# EAGLE design Witch (EAGLE 9.6.2)
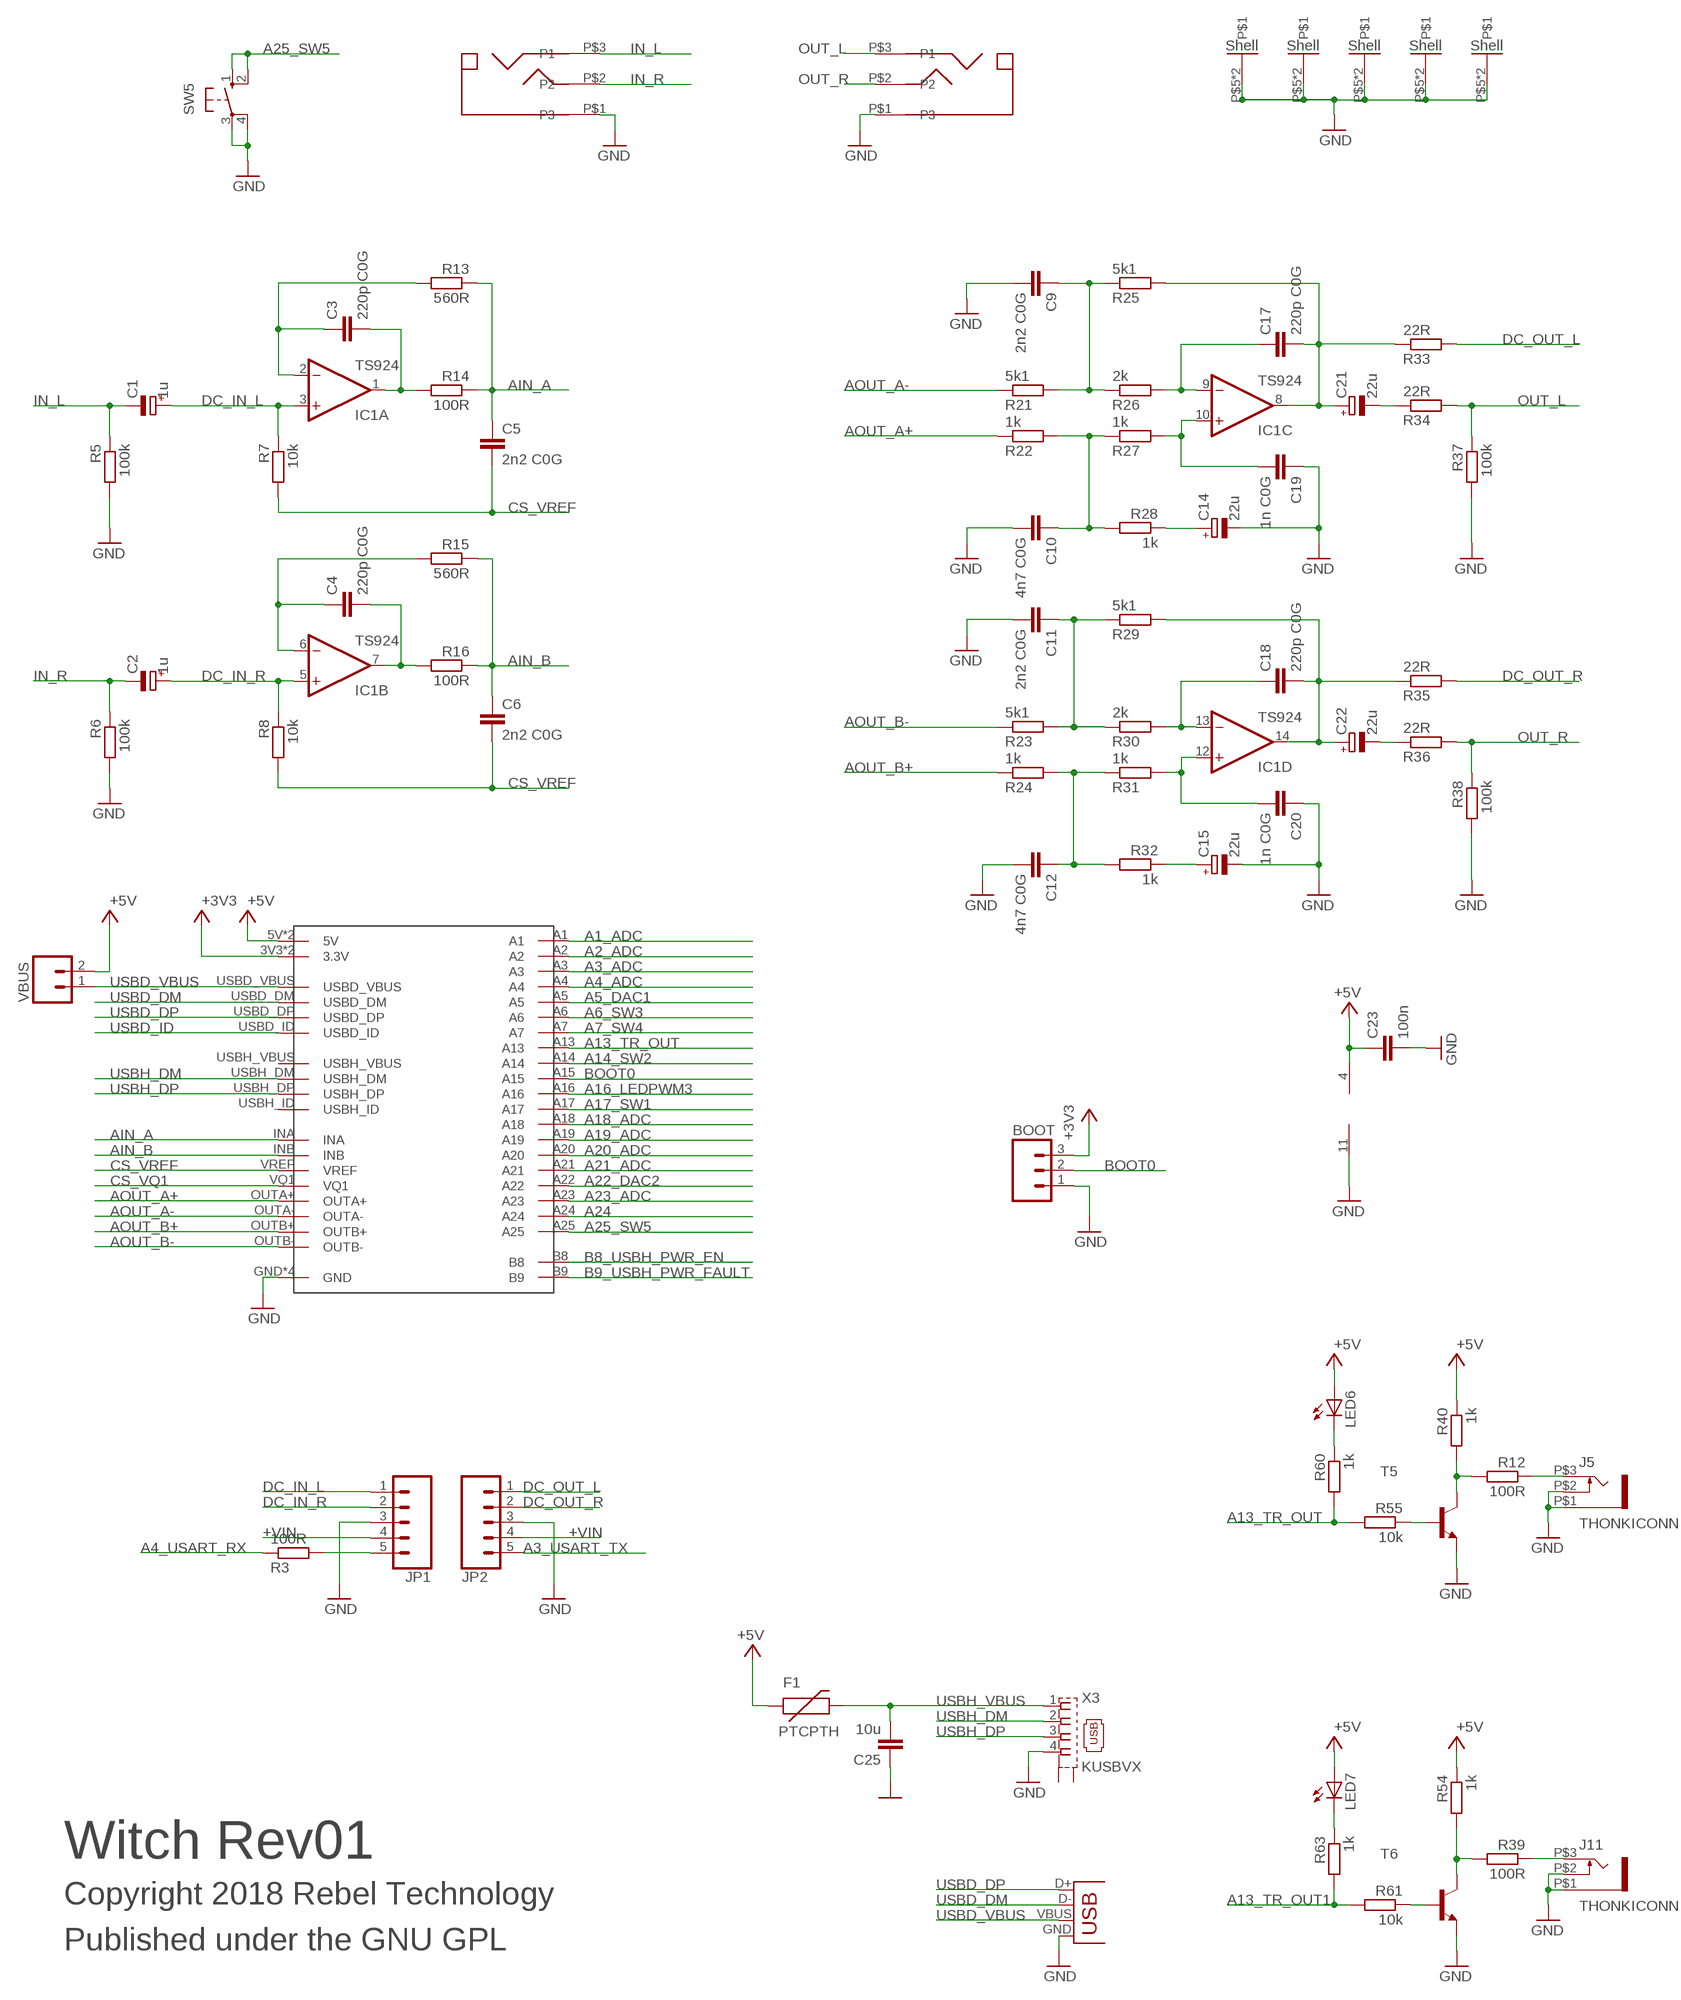
[diagram p0: schematic, sheet 1, part 1 of 2]
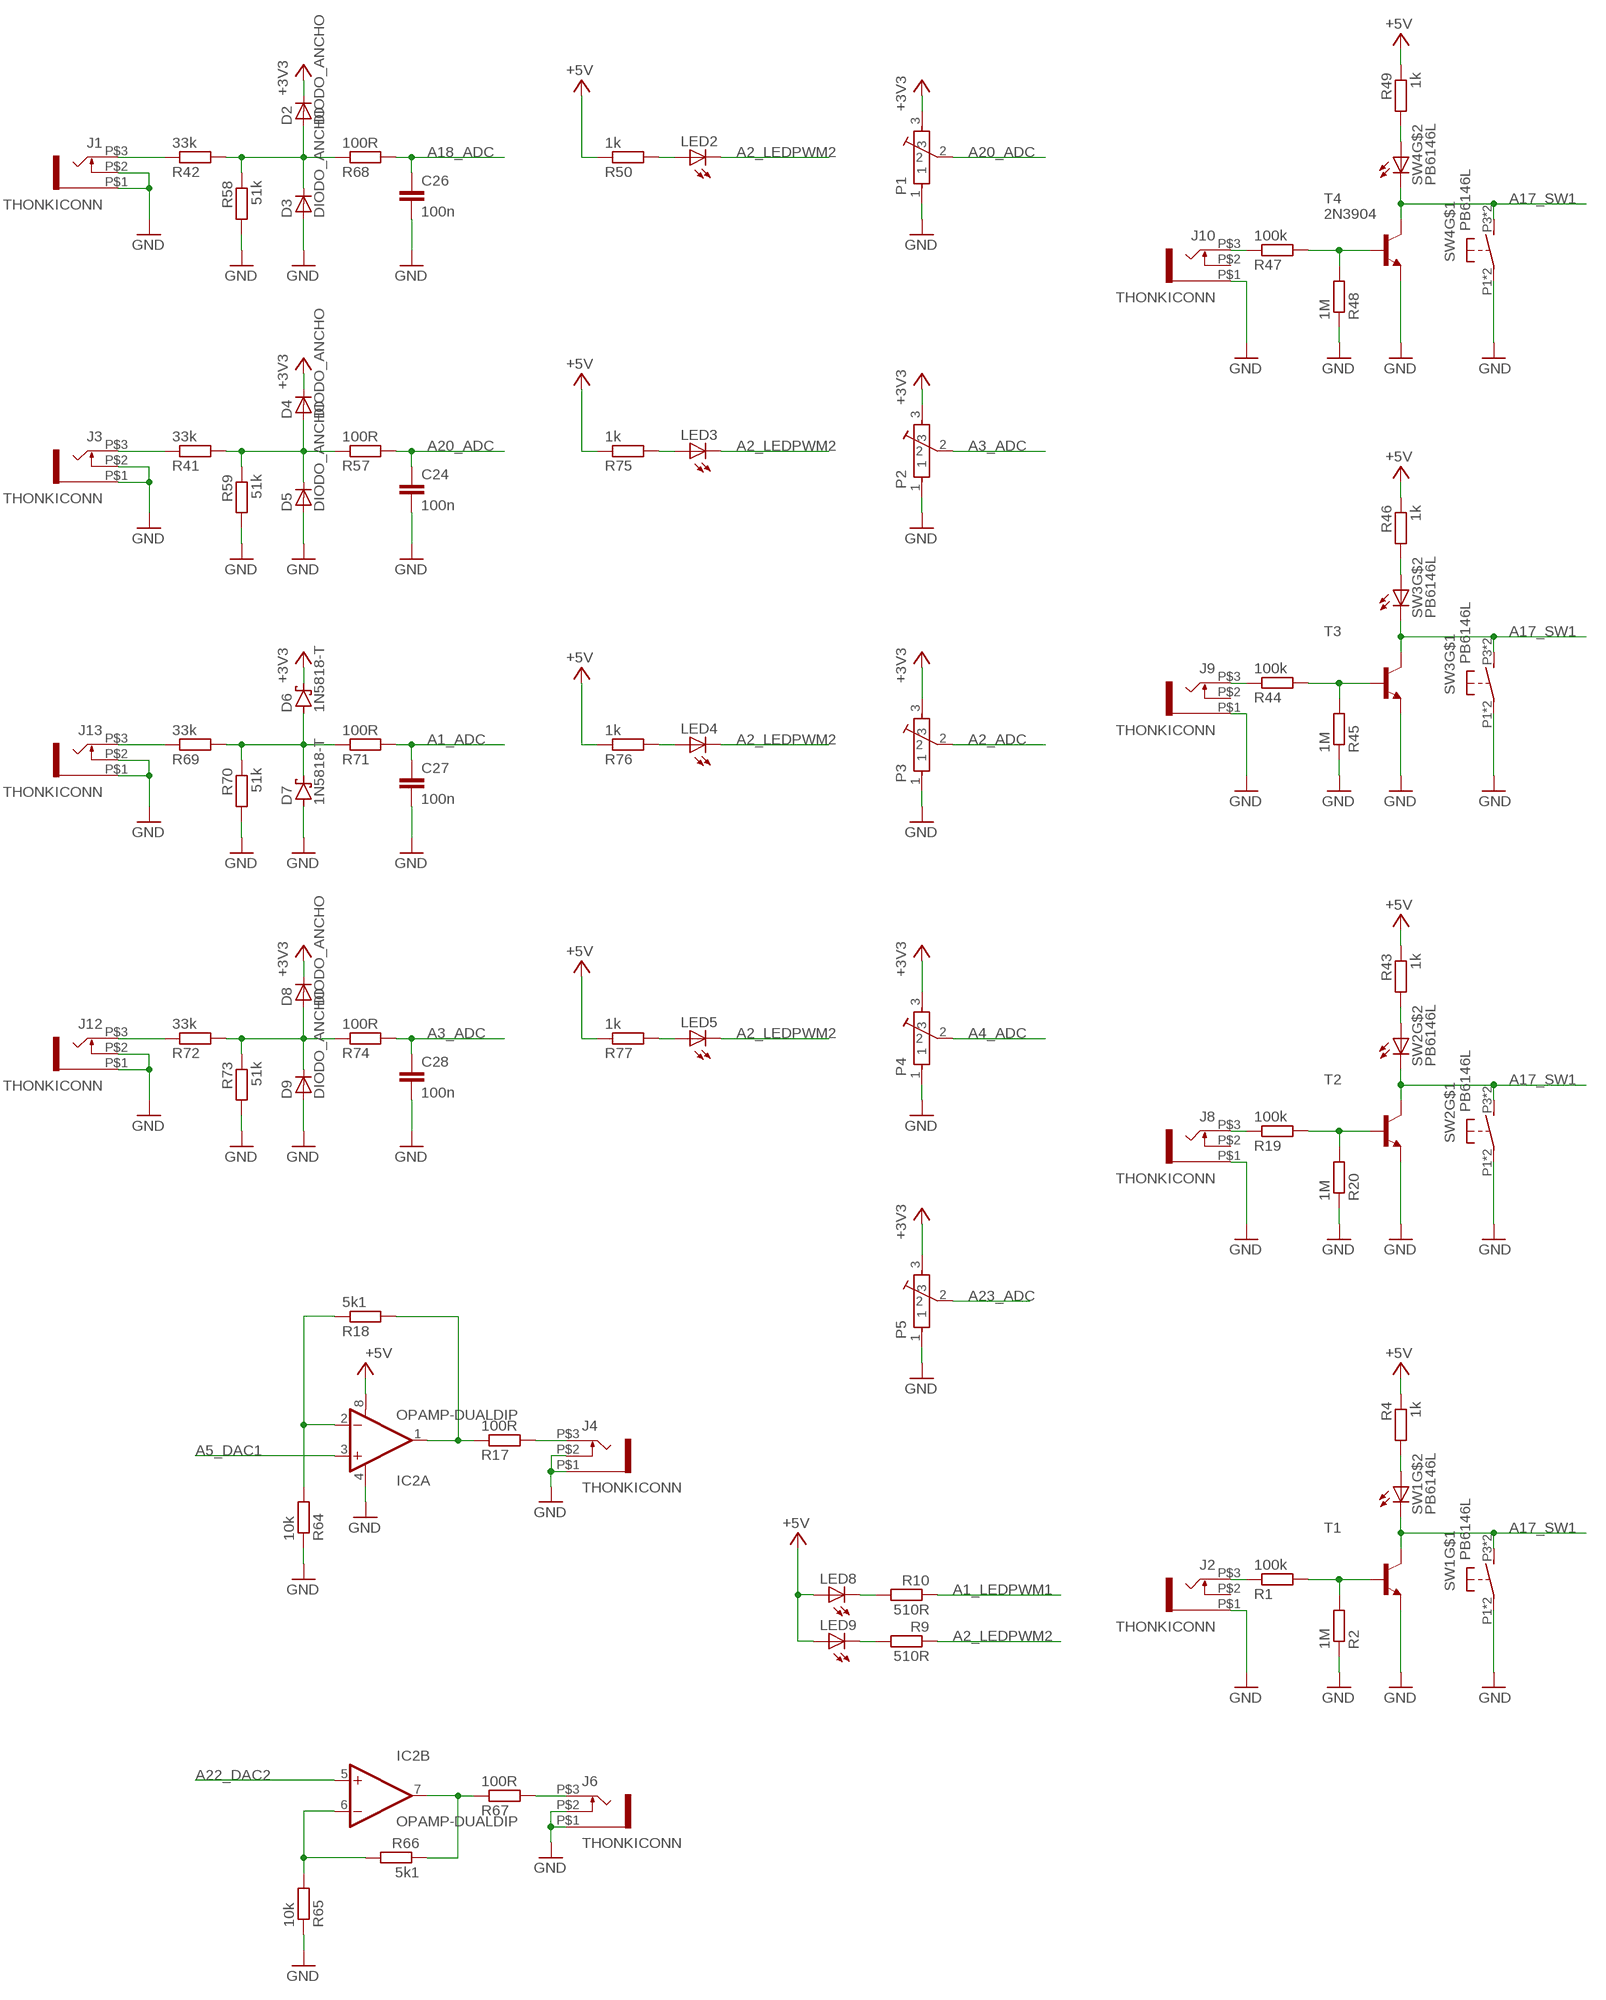
[diagram p1: schematic, sheet 1, part 2 of 2]

## Parts
BOOT  M03PTH  [1X03]
C1  1u  CPOL-EUE1.8-4  [E1,8-4]
C2  1u  CPOL-EUE1.8-4  [E1,8-4]
C3  220p C0G  C-EU050-025X075  [C050-025X075]
C4  220p C0G  C-EU050-025X075  [C050-025X075]
C5  2n2 C0G  C-EU050-025X075  [C050-025X075]
C6  2n2 C0G  C-EU050-025X075  [C050-025X075]
C9  2n2 C0G  C-EU050-025X075  [C050-025X075]
C10  4n7 C0G  C-EU050-025X075  [C050-025X075]
C11  2n2 C0G  C-EU050-025X075  [C050-025X075]
C12  4n7 C0G  C-EU050-025X075  [C050-025X075]
C14  22u  CPOL-EUE1.8-4  [E1,8-4]
C15  22u  CPOL-EUE1.8-4  [E1,8-4]
C17  220p C0G  C-EU050-025X075  [C050-025X075]
C18  220p C0G  C-EU050-025X075  [C050-025X075]
C19  1n C0G  C-EU050-025X075  [C050-025X075]
C20  1n C0G  C-EU050-025X075  [C050-025X075]
C21  22u  CPOL-EUE1.8-4  [E1,8-4]
C22  22u  CPOL-EUE1.8-4  [E1,8-4]
C23  100n  C-EU050-025X075  [C050-025X075]
C24  100n  C-EU050-025X075  [C050-025X075]
C25  10u  C-EU050-025X075  [C050-025X075]
C26  100n  C-EU050-025X075  [C050-025X075]
C27  100n  C-EU050-025X075  [C050-025X075]
C28  100n  C-EU050-025X075  [C050-025X075]
D2  DIODO_ANCHO  [D-5.2]
D3  DIODO_ANCHO  [D-5.2]
D4  DIODO_ANCHO  [D-5.2]
D5  DIODO_ANCHO  [D-5.2]
D6  1N5818-T  [DO41-7.6]
D7  1N5818-T  [DO41-7.6]
D8  DIODO_ANCHO  [D-5.2]
D9  DIODO_ANCHO  [D-5.2]
F1  PTCPTH  [PTC]
IC1  TS924  LM324N  [DIL14]
IC2  OPAMP-DUALDIP  [DIP08]
J1  THONKICONN  [THONKICONN]
J2  THONKICONN  [THONKICONN]
J3  THONKICONN  [THONKICONN]
J4  THONKICONN  [THONKICONN]
J5  THONKICONN  [THONKICONN]
J6  THONKICONN  [THONKICONN]
J8  THONKICONN  [THONKICONN]
J9  THONKICONN  [THONKICONN]
J10  THONKICONN  [THONKICONN]
J11  THONKICONN  [THONKICONN]
J12  THONKICONN  [THONKICONN]
J13  THONKICONN  [THONKICONN]
JP1  CONN_05JST-VERT  [JST-5-PTH-VERT]
JP2  CONN_05JST-VERT  [JST-5-PTH-VERT]
LED2  LED3MM  [LED3MM]
LED3  LED3MM  [LED3MM]
LED4  LED3MM  [LED3MM]
LED5  LED3MM  [LED3MM]
LED6  LED3MM  [LED3MM]
LED7  LED3MM  [LED3MM]
LED8  LED3MM  [LED3MM]
LED9  LED3MM  [LED3MM]
P1  POT-ALPS-RK09L1140  [POT-ALPS-RK09L1140]
P2  POT-ALPS-RK09L1140  [POT-ALPS-RK09L1140]
P3  POT-ALPS-RK09L1140  [POT-ALPS-RK09L1140]
P4  POT-ALPS-RK09L1140  [POT-ALPS-RK09L1140]
P5  POT-ALPS-RK09L1140  [POT-ALPS-RK09L1140]
R1  100k  R-EU_0204/5  [0204/5]
R2  1M  R-EU_0204/5  [0204/5]
R3  100R  R-EU_0204/5  [0204/5]
R4  1k  R-EU_0204/5  [0204/5]
R5  100k  R-EU_0204/5  [0204/5]
R6  100k  R-EU_0204/5  [0204/5]
R7  10k  R-EU_0204/5  [0204/5]
R8  10k  R-EU_0204/5  [0204/5]
R9  510R  R-EU_0204/5  [0204/5]
R10  510R  R-EU_0204/5  [0204/5]
R12  100R  R-EU_0204/5  [0204/5]
R13  560R  R-EU_0204/5  [0204/5]
R14  100R  R-EU_0204/5  [0204/5]
R15  560R  R-EU_0204/5  [0204/5]
R16  100R  R-EU_0204/5  [0204/5]
R17  100R  R-EU_0204/5  [0204/5]
R18  5k1  R-EU_0204/5  [0204/5]
R19  100k  R-EU_0204/5  [0204/5]
R20  1M  R-EU_0204/7  [0204/7]
R21  5k1  R-EU_0204/5  [0204/5]
R22  1k  R-EU_0204/5  [0204/5]
R23  5k1  R-EU_0204/5  [0204/5]
R24  1k  R-EU_0204/5  [0204/5]
R25  5k1  R-EU_0204/5  [0204/5]
R26  2k  R-EU_0204/5  [0204/5]
R27  1k  R-EU_0204/5  [0204/5]
R28  1k  R-EU_0204/5  [0204/5]
R29  5k1  R-EU_0204/5  [0204/5]
R30  2k  R-EU_0204/5  [0204/5]
R31  1k  R-EU_0204/5  [0204/5]
R32  1k  R-EU_0204/5  [0204/5]
R33  22R  R-EU_0204/5  [0204/5]
R34  22R  R-EU_0204/5  [0204/5]
R35  22R  R-EU_0204/5  [0204/5]
R36  22R  R-EU_0204/5  [0204/5]
R37  100k  R-EU_0204/5  [0204/5]
R38  100k  R-EU_0204/5  [0204/5]
R39  100R  R-EU_0204/5  [0204/5]
R40  1k  R-EU_0204/5  [0204/5]
R41  33k  R-EU_0204/5  [0204/5]
R42  33k  R-EU_0204/5  [0204/5]
R43  1k  R-EU_0204/5  [0204/5]
R44  100k  R-EU_0204/5  [0204/5]
R45  1M  R-EU_0204/5  [0204/5]
R46  1k  R-EU_0204/5  [0204/5]
R47  100k  R-EU_0204/5  [0204/5]
R48  1M  R-EU_0204/5  [0204/5]
R49  1k  R-EU_0204/5  [0204/5]
R50  1k  R-EU_0204/5  [0204/5]
R54  1k  R-EU_0204/5  [0204/5]
R55  10k  R-EU_0204/5  [0204/5]
R57  100R  R-EU_0204/5  [0204/5]
R58  51k  R-EU_0204/5  [0204/5]
R59  51k  R-EU_0204/5  [0204/5]
R60  1k  R-EU_0204/5  [0204/5]
R61  10k  R-EU_0204/5  [0204/5]
R63  1k  R-EU_0204/5  [0204/5]
R64  10k  R-EU_0204/5  [0204/5]
R65  10k  R-EU_0204/5  [0204/5]
R66  5k1  R-EU_0204/5  [0204/5]
R67  100R  R-EU_0204/5  [0204/5]
R68  100R  R-EU_0204/5  [0204/5]
R69  33k  R-EU_0204/5  [0204/5]
R70  51k  R-EU_0204/5  [0204/5]
R71  100R  R-EU_0204/5  [0204/5]
R72  33k  R-EU_0204/5  [0204/5]
R73  51k  R-EU_0204/5  [0204/5]
R74  100R  R-EU_0204/5  [0204/5]
R75  1k  R-EU_0204/5  [0204/5]
R76  1k  R-EU_0204/5  [0204/5]
R77  1k  R-EU_0204/5  [0204/5]
SW1  PB6146L  [PB6146L]
SW2  PB6146L  [PB6146L]
SW3  PB6146L  [PB6146L]
SW4  PB6146L  [PB6146L]
SW5  10-XX  [B3F-10XX]
T1  2N3904-NPN-TO92-EBC  [TO92-EBC]
T2  2N3904-NPN-TO92-EBC  [TO92-EBC]
T3  2N3904-NPN-TO92-EBC  [TO92-EBC]
T4  2N3904  [TO92]
T5  2N3904-NPN-TO92-EBC  [TO92-EBC]
T6  2N3904-NPN-TO92-EBC  [TO92-EBC]
U$4  THONKICONN_STEREO  [THONKICONN_STEREO]
U$5  THONKICONN_STEREO  [THONKICONN_STEREO]
U$10  OWL_DIGITAL_LITE_2USB  [OWL_DIGITAL_LITE_2USB]
VBUS  M02PTH  [1X02]
X3  KUSBVX  [KUSBVX]
X5  USBPTH-VERTICAL  [USB-B-PTH-VERTICAL]

## Nets
+3V3: BOOT.3 D2.C D4.C D6.C D8.C P1.3 P2.3 P3.3 P4.3 P5.3 U$10.3V3(3.3V) U$10.3V3_2(3.3V)
+5V: C23.1 F1.P$1 IC1.4(P:V+) IC2.8(A:V+) LED6.A LED7.A LED8.A LED9.A R4.1 R40.1 R43.1 R46.1 R49.1 R50.1 R54.1 R75.1 R76.1 R77.1 U$10.5V U$10.5V_2(5V) VBUS.2
+VIN: JP1.4 JP2.4
A1_ADC: C27.1 R71.2 U$10.A1
A1_LEDPWM1: R10.1
A2_ADC: P3.2 U$10.A2
A2_LEDPWM2: LED2.K(C) LED3.K(C) LED4.K(C) LED5.K(C) R9.1
A3_ADC: C28.1 R74.2 U$10.A3
A3_USART_TX: JP2.5
A4_ADC: P4.2 U$10.A4
A4_USART_RX: R3.1
A5_DAC1: IC2.3(A:+IN) U$10.A5
A6_SW3: U$10.A6
A7_SW4: U$10.A7
A13_TR_OUT: R55.2 R60.2 U$10.A13
A13_TR_OUT1: R61.2 R63.2
A14_SW2: U$10.A14
A16_LEDPWM3: U$10.A16
A17_SW1: SW1.P3(S) SW1.P4(S) SW1.PL2(C) SW2.P3(S) SW2.P4(S) SW2.PL2(C) SW3.P3(S) SW3.P4(S) SW3.PL2(C) SW4.P3(S) SW4.P4(S) SW4.PL2(C) T1.C T2.C T3.C T4.1(C) U$10.A17
A18_ADC: C26.1 R68.2 U$10.A18
A19_ADC: P1.2 U$10.A19
A20_ADC: C24.1 R57.2 U$10.A20
A21_ADC: P2.2 U$10.A21
A22_DAC2: IC2.5(B:+IN) U$10.A22
A23_ADC: P5.2 U$10.A23
A24: U$10.A24
A25_SW5: SW5.1(S) SW5.2(S1) U$10.A25
AIN_A: C5.1 R13.1 R14.1 U$10.INA
AIN_B: C6.1 R15.1 R16.1 U$10.INB
AOUT_A+: R22.1 U$10.OUTA+
AOUT_A-: R21.1 U$10.OUTA-
AOUT_B+: R24.1 U$10.OUTB+
AOUT_B-: R23.1 U$10.OUTB-
B8_USBH_PWR_EN: U$10.B8
B9_USBH_PWR_FAULT: U$10.B9
BOOT0: BOOT.2 U$10.A15
CS_VQ1: U$10.VQ1
CS_VREF: C5.2 C6.2 R7.2 R8.2 U$10.VREF
DC_IN_L: C1.+ IC1.3(A:+IN) JP1.1 R7.1
DC_IN_R: C2.+ IC1.5(B:+IN) JP1.2 R8.1
DC_OUT_L: JP2.1 R33.2
DC_OUT_R: JP2.2 R35.2
GND: BOOT.1 C9.2 C10.2 C11.2 C12.2 C14.- C15.- C19.1 C20.1 C23.2 C24.2 C25.1 C26.2 C27.2 C28.2 D3.A D5.A D7.A D9.A IC1.11(P:V-) IC2.4(A:V-) J1.P$1 J1.P$2 J2.P$1 J3.P$1 J3.P$2 J4.P$1 J4.P$2 J5.P$1 J5.P$2 J6.P$1 J6.P$2 J8.P$1 J9.P$1 J10.P$1 J11.P$1 J11.P$2 J12.P$1 J12.P$2 J13.P$1 J13.P$2 JP1.3 JP2.3 P1.1 P1.P$5 P1.P$6 P2.1 P2.P$5 P2.P$6 P3.1 P3.P$5 P3.P$6 P4.1 P4.P$5 P4.P$6 P5.1 P5.P$5 P5.P$6 R2.1 R5.2 R6.2 R20.1 R37.2 R38.2 R45.1 R48.1 R58.2 R59.2 R64.1 R65.1 R70.2 R73.2 SW1.P1(P) SW1.P2(P) SW2.P1(P) SW2.P2(P) SW3.P1(P) SW3.P2(P) SW4.P1(P) SW4.P2(P) SW5.3(P) SW5.4(P1) T1.E T2.E T3.E T4.3(E) T5.E T6.E U$4.P$1(P3) U$5.P$1(P3) U$10.GND U$10.GND_2(GND) U$10.GND_3(GND) U$10.GND_4(GND) X3.4 X5.GND
IN_L: C1.- R5.1 U$4.P$3(P1)
IN_R: C2.- R6.1 U$4.P$2(P2)
N$1: JP1.5 R3.2
N$2: J11.P$3 R39.1
N$3: C3.1 IC1.2(A:-IN) R13.2
N$4: C4.2 IC1.7(B:OUT) R16.2
N$5: C4.1 IC1.6(B:-IN) R15.2
N$6: C3.2 IC1.1(A:OUT) R14.2
N$7: C17.1 IC1.9(C:-IN) R26.2
N$8: C15.+ R32.1
N$9: C21.- R34.1
N$10: C14.+ R28.1
N$11: C19.2 IC1.10(C:+IN) R27.2
N$12: C18.2 C22.+ IC1.14(D:OUT) R29.2 R35.1
N$13: C22.- R36.1
N$14: LED8.K(C) R10.2
N$15: C10.1 R22.2 R27.1 R28.2
N$16: LED9.K(C) R9.2
N$17: D4.A D5.C R41.2 R57.1 R59.1
N$18: LED7.K(C) R63.1
N$19: J5.P$3 R12.1
N$20: IC2.2(A:-IN) R18.1 R64.2
N$21: IC2.1(A:OUT) R17.1 R18.2
N$22: J2.P$3 R1.1
N$23: R39.2 R54.2 T6.C
N$24: C11.1 R23.2 R29.1 R30.1
N$25: R12.2 R40.2 T5.C
N$26: C18.1 IC1.13(D:-IN) R30.2
N$27: J3.P$3 R41.1
N$28: R4.2 SW1.PL1(A)
N$29: R19.2 R20.2 T2.B
N$30: C20.2 IC1.12(D:+IN) R31.2
N$31: R55.1 T5.B
N$32: C12.1 R24.2 R31.1 R32.2
N$33: J1.P$3 R42.1
N$34: J8.P$3 R19.1
N$35: R43.2 SW2.PL1(A)
N$36: R44.2 R45.2 T3.B
N$37: R1.2 R2.2 T1.B
N$38: J9.P$3 R44.1
N$39: C17.2 C21.+ IC1.8(C:OUT) R25.2 R33.1
N$40: R46.2 SW3.PL1(A)
N$41: C9.1 R21.2 R25.1 R26.1
N$42: R47.2 R48.2 T4.2(B)
N$43: J10.P$3 R47.1
N$44: R49.2 SW4.PL1(A)
N$45: LED2.A R50.2
N$46: LED6.K(C) R60.1
N$52: D2.A D3.C R42.2 R58.1 R68.1
N$53: J13.P$3 R69.1
N$54: R61.1 T6.B
N$58: D6.A D7.C R69.2 R70.1 R71.1
N$59: J12.P$3 R72.1
N$60: J4.P$3 R17.2
N$61: IC2.6(B:-IN) R65.2 R66.2
N$62: IC2.7(B:OUT) R66.1 R67.1
N$63: J6.P$3 R67.2
N$64: D8.A D9.C R72.2 R73.1 R74.1
N$65: LED3.A R75.2
N$66: LED4.A R76.2
N$67: LED5.A R77.2
OUT_L: R34.2 R37.1 U$5.P$3(P1)
OUT_R: R36.2 R38.1 U$5.P$2(P2)
USBD_DM: U$10.USBD_DM X5.D-
USBD_DP: U$10.USBD_DP X5.D+
USBD_ID: U$10.USBD_ID
USBD_VBUS: U$10.USBD_VBUS VBUS.1 X5.VBUS
USBH_DM: U$10.USBH_DM X3.2
USBH_DP: U$10.USBH_DP X3.3
USBH_VBUS: C25.2 F1.P$2 X3.1
Unconnected: J2.P$2 J8.P$2 J9.P$2 J10.P$2 U$10.USBH_ID U$10.USBH_VBUS X3.M1(S1) X3.M2(S2)

## Notes on the sheet
- Witch Rev01
- Copyright 2018 Rebel Technology
- Published under the GNU GPL

## Library data of the parts
BOOT = SparkFun:M03: Header 3 Standard 3-pin 0.1" header. Use with straight break away headers (SKU : PRT-00116), right angle break away headers (PRT-00553), swiss pins (PRT-00743), machine pins (PRT-00117), and female headers (PRT-00115). Molex polarized connector foot print use with SKU : PRT-08232 with associated crimp pins and housings.
C1 C2 C14 C15 C21 C22 = rcl:CPOL-EU: POLARIZED CAPACITOR, European symbol
C3-C6 C9-C12 C17-C20 C23-C28 = rcl:C-EU: CAPACITOR, European symbol
D2-D5 D8 D9 = diode:DIODO_ANCHO
D6 D7 = diode:1N581*: 1.0A SCHOTTKY BARRIER RECTIFIER Source: http://www.diodes.com/datasheets/ds23001.pdf
F1 = Rebel:PTC: Resettable Fuse PTC Resettable Fuse. Bourns MF-R, Raychem PolySwitch RXE.
IC1 = linear:LM324: OP AMP
IC2 = SparkFun:OPAMP-DUAL: Operational Amplifier
J1-J6 J8-J13 = Rebel:THONKICONN
JP1 JP2 = SparkFun-Connectors:CONN_05: Multi connection point. Often used as Generic Header-pin footprint for 0.1 inch spaced/style header connections On any of the 0.1 inch spaced packages, you can populate with these: Break Away Headers - Straight <https://www.sparkfun.com/products/116> (PRT-00116) Break Away Male Headers - Right Angle <https://www.sparkfun.com/products/553> (PRT-00553) Female Headers <https://www.sparkfun.com/products/115> (PRT-00115) Break Away Headers - Machine Pin <https://www.sparkfun.com/products/117> (PRT-00117) Break Away Female Headers - Swiss Machine Pin <https://www.sparkfun.com/products/743> (PRT-00743) For SCREWTERMINALS and SPRING TERMINALS visit here: Screw Terimnals on SparkFun.com <https://www.sparkfun.com/search/results?term=Screw+Terminals> (5mm/3.5mm/2.54mm spacing) This device is also useful as a general connection point to wire up your design to another part of your project. Our various solder wires solder well into these plated through hole pads. Hook-Up Wire - Assortment (Stranded, 22 AWG) <https://www.sparkfun.com/products/11375> (PRT-11375) Hook-Up Wire - Assortment (Solid Core, 22 AWG) <https://www.sparkfun.com/products/11367> (PRT-11367) View the entire wire category on our website here <https://www.sparkfun.com/categories/141> Special notes: Molex polarized connector foot print use with SKU : PRT-08231 with associated crimp pins and housings. 1MM SMD Version SKU: PRT-10208
LED2-LED9 = Rebel:LED: LED
P1-P5 = Rebel:POT-ALPS-RK09L
R1-R10 R12-R19 R21-R50 R54 R55 R57-R61 R63-R77 = rcl:R-EU_: RESISTOR, European symbol
R20 = Rebel:R-EU_: RESISTOR, European symbol
SW1-SW4 = Rebel:PB6146L
SW5 = switch-omron:10-XX: OMRON SWITCH; MPN: B3F-1000; OC_FARNELL: 176432; OC_NEWARK: 36M3542
T1-T3 T5 T6 = transistor-neu-to92:*-NPN-: NPN Transistror
T4 = transistor-npn:2N3904: NPN Transistor
U$4 U$5 = Rebel:THONKICONN_STEREO
U$10 = Rebel platforms:OWL_DIGITAL_LITE_2USB
VBUS = SparkFun:M02: Header 2 Standard 2-pin 0.1" header. Use with straight break away headers (SKU : PRT-00116), right angle break away headers (PRT-00553), swiss pins (PRT-00743), machine pins (PRT-00117), and female headers (PRT-00115). Molex polarized connector foot print use with SKU : PRT-08233 with associated crimp pins and housings.
X3 = con-kycon:KUSBVX: Vertical,Top Entry Universal Serial Bus Connector KUSBVX Series Source: KYCON Sibalco USB vertical socket KUSBV.pdf
X5 = SparkFun:USB: USB Connectors USB-B-PTH is fully proven SKU : PRT-00139 USB-miniB is fully proven SKU : PRT-00587 USB-A-PCB is untested. USB-A-H is throughly reviewed, but untested. Spark Fun Electronics SKU : PRT-00437 USB-B-SMT is throughly reviewed, but untested. Needs silkscreen touching up. USB-A-S has not been used/tested USB-MB-H has not been used/tested

## Net classes
1 power: width 0.178 mm, drill 0.305 mm, clearance 0.178 mm to class 0, clearance 0.178 mm

## Board
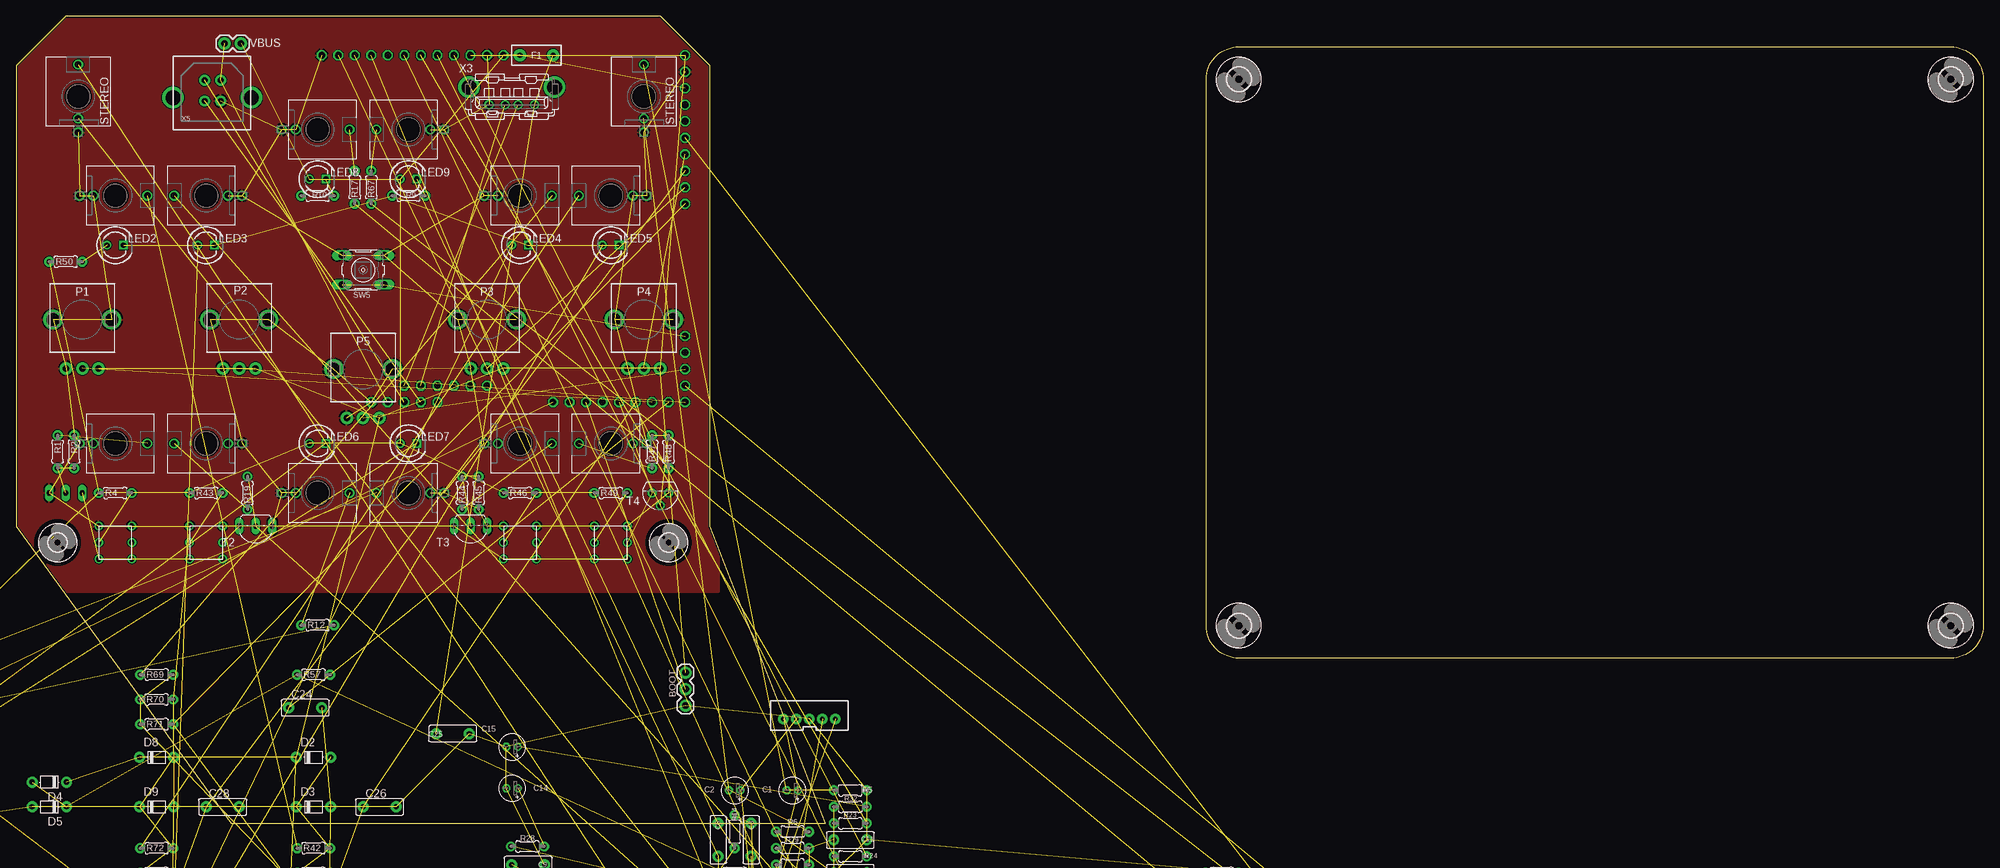
[diagram p2: board, top side]
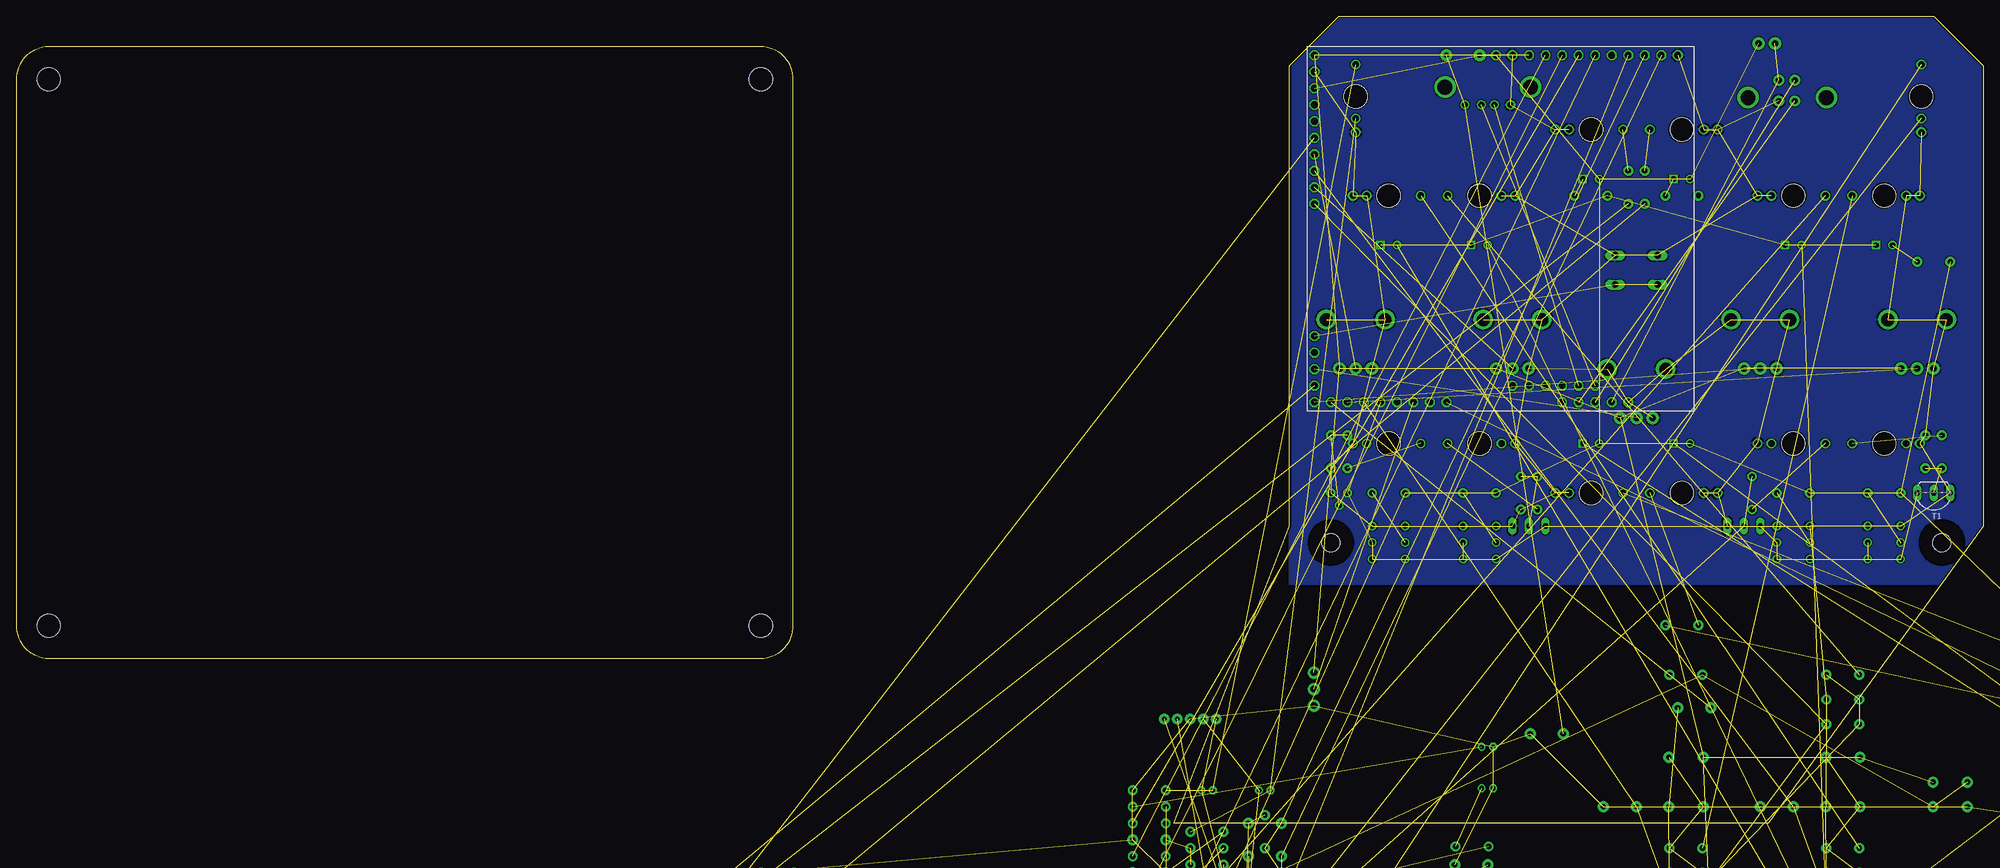
[diagram p3: board, bottom side, seen from below]

Size 302.52 x 124.1 mm. Coordinates in mm from the lower left corner, seen from the top.
Outline: 99.06,124.1 7.62,124.1 0,116.48 0,45.72 33.02,0 124.46,0 106.68,45.72 106.68,116.48 99.06,124.1
Outline: 297.52,25.4 188.02,25.4 arc-90 183.02,30.4 183.02,114.4 arc-90 188.02,119.4 297.52,119.4 arc-90 302.52,114.4 302.52,30.4 arc-90 297.52,25.4
Copper layers (1*16): Top 0.035mm / dielectric 1.5mm / Bottom 0.035mm
Design rules "Fusion_eagle_rule_v1.1": minimum track width 6mil, minimum drill 12mil, track to track 6mil, track to pad 6mil, pad to pad 6mil, via to via 6mil, smd to smd 0mil, copper to edge 10mil, drill to drill 10mil, minimum pad ring 10mil, minimum via ring 6mil, stop-mask expansion 2mil, vias tented up to drill 100mil, thermal gap 10mil

### Footprints (pad centres in the part's own frame; a part is rotated, then mirrored left to right if it is on the bottom)
1X03 = drill 1.016 pad 1.88: 1 0,0; 2 2.54,0; 3 5.08,0
E1,8-4 = drill 0.711 pad 1.168: + -0.889,0 | drill 0.711 pad 1.168 octagon: - 0.889,0
C050-025X075 = drill 0.813 pad 1.676: 1 -2.54,0; 2 2.54,0
D-5.2 = drill 0.813 pad 1.676: A 2.64,0; C -2.64,0
DO41-7.6 = drill 1.1 pad 1.7: A 3.81,0; C -3.81,0
PTC = drill 0.8 pad 1.88: P$1 -2.54,0; P$2 2.54,0
DIL14 = drill 0.813 long: 1 -7.62,-3.81; 2 -5.08,-3.81; 3 -2.54,-3.81; 4 0,-3.81; 5 2.54,-3.81; 6 5.08,-3.81; 7 7.62,-3.81; 8 7.62,3.81; 9 5.08,3.81; 10 2.54,3.81; 11 0,3.81; 12 -2.54,3.81; 13 -5.08,3.81; 14 -7.62,3.81
DIP08 = drill 0.813 pad 1.727 octagon: 1 -3.81,-3.81; 2 -1.27,-3.81; 3 1.27,-3.81; 4 3.81,-3.81; 5 3.81,3.81; 6 1.27,3.81; 7 -1.27,3.81; 8 -3.81,3.81
THONKICONN = drill 1: P$1 0,-5.5; P$2 0,-3.38; P$3 0,4.92 | hole 3.6: 0,0
JST-5-PTH-VERT = drill 0.7 pad 1.6: 1 -4,0.18; 2 -2,0.18; 3 0,0.18; 4 2,0.18; 5 4,0.18
LED3MM = drill 0.813: A -1.27,0 | drill 0.813 square: K 1.27,0
POT-ALPS-RK09L1140 = drill 1 pad 1.93: 1 -2.5,-7.5; 2 0,-7.5; 3 2.5,-7.5 | drill 2: P$5 -4.5,0; P$6 4.5,0
0204/5 = drill 0.813 pad 1.524: 1 -2.54,0; 2 2.54,0
0204/7 = drill 0.813: 1 -3.81,0; 2 3.81,0
PB6146L = drill 0.8: P1 -2.54,2.54; P2 2.54,2.54; P3 -2.54,-2.54; P4 2.54,-2.54; PL1 -2.54,0; PL2 2.54,0
B3F-10XX = drill 1.016 long: 1 -3.251,2.261; 2 3.251,2.261; 3 -3.251,-2.261; 4 3.251,-2.261
TO92-EBC = drill 0.813 long: B 0,-1.27; C 2.54,-1.27; E -2.54,-1.27
TO92 = drill 0.813 octagon: 1 1.27,0; 2 0,1.905; 3 -1.27,0
2,8 = hole 2.8: 0,0
THONKICONN_STEREO = drill 1: P$1 0,-5.5; P$2 0,-3.38; P$3 0,4.92 | hole 3.6: 0,0
3,6 = hole 3.6: 0,0
OWL_DIGITAL_LITE_2USB = drill 1.016 octagon: 3V3 25.4,1.27; 3V3_2 58.42,1.27; 5V 30.48,1.27; 5V_2 58.42,6.35; A1 58.42,24.13; A2 58.42,21.59; A3 58.42,19.05; A4 58.42,16.51; A5 58.42,13.97; A6 58.42,11.43; A7 58.42,8.89; A13 38.1,54.61; A14 40.64,54.61; A15 43.18,54.61; A16 45.72,54.61; A17 48.26,54.61; A18 50.8,54.61; A19 53.34,54.61; A20 55.88,54.61; A21 58.42,54.61; A22 58.42,52.07; A23 58.42,49.53; A24 58.42,46.99; A25 58.42,44.45; B8 25.4,52.07; B9 27.94,52.07; GND 2.54,1.27; GND_2 27.94,1.27; GND_3 58.42,3.81; GND_4 10.16,54.61; INA 7.62,1.27; INB 10.16,1.27; OUTA+ 20.32,1.27; OUTA- 15.24,1.27; OUTB+ 22.86,1.27; OUTB- 17.78,1.27; USBD_DM 15.24,54.61; USBD_DP 17.78,54.61; USBD_ID 20.32,54.61; USBD_VBUS 12.7,54.61; USBH_DM 15.24,52.07; USBH_DP 17.78,52.07; USBH_ID 20.32,52.07; USBH_VBUS 22.86,52.07; VQ1 12.7,1.27; VREF 5.08,1.27
1X02 = drill 1.016 pad 1.88: 1 0,0; 2 2.54,0
KUSBVX = drill 0.9 pad 1.3: 1 3.5,0; 2 1,0; 3 -1,0; 4 -3.5,0 | drill 2.3 pad 2.8: M1 -6.57,2.71; M2 6.57,2.71
USB-B-PTH-VERTICAL = drill 0.914 pad 1.676: D+ 4.826,4.394; D- 4.826,7.595; GND 7.315,4.394; VBUS 7.315,7.595 | drill 2.286: P$1 0,4.902; P$2 12.04,4.902

### Placement (x,y rotation side)
BOOT  102.93,18.1 90 top
C1  119.38,5.08 180 top
C2  110.49,5.08 180 top
C3  113.03,-2.54 90 top
C4  107.95,-25.4 270 top  (outside the outline)
C5  107.95,-2.54 270 top
C6  107.95,-17.78 90 top  (outside the outline)
C9  78.74,-6.35 0 top  (outside the outline)
C10  128.27,-12.7 180 top  (outside the outline)
C11  128.27,-2.54 0 top
C12  128.27,-7.62 180 top  (outside the outline)
C14  76.26,5.4 180 top
C15  76.26,11.75 180 top
C17  129.54,-22.86 90 top  (outside the outline)
C18  119.38,-8.89 0 top  (outside the outline)
C19  127,-22.86 270 top  (outside the outline)
C20  124.4,-22.86 90 top  (outside the outline)
C21  107.95,-31.75 0 top  (outside the outline)
C22  128.27,-40.64 90 top  (outside the outline)
C23  119.38,-11.43 0 top  (outside the outline)
C24  44.45,17.78 0 top
C25  67.14,13.79 180 top
C26  55.88,2.54 0 top
C27  55.88,-24.13 0 top  (outside the outline)
C28  31.75,2.54 0 top
D2  45.72,10.16 0 top
D3  45.72,2.54 0 top
D4  5.08,6.35 180 top
D5  5.08,2.54 180 top
D6  45.72,-16.51 0 top  (outside the outline)
D7  45.72,-24.13 0 top  (outside the outline)
D8  21.59,10.16 0 top
D9  21.59,2.54 0 top
F1  80.01,118.11 0 top
IC1  117.41,-23.18 270 top  (outside the outline)
IC2  205.74,-25.4 0 top  (outside the outline)
J1  15.24,96.52 270 top
J2  15.24,58.42 270 top
J3  29.21,96.52 90 top
J4  46.36,106.68 270 top
J5  46.36,50.8 270 top
J6  60.33,106.68 90 top
J8  29.21,58.42 90 top
J9  77.47,58.42 270 top
J10  91.44,58.42 90 top
J11  60.33,50.8 90 top
J12  91.44,96.52 90 top
J13  77.47,96.52 270 top
JP1  121.98,15.88 0 top
JP2  110.43,-50.17 0 top  (outside the outline)
LED2  15.24,88.9 0 top
LED3  29.21,88.9 0 top
LED4  77.47,88.9 0 top
LED5  91.44,88.9 0 top
LED6  46.36,58.42 0 top
LED7  60.33,58.42 0 top
LED8  46.36,99.06 0 top
LED9  60.33,99.06 0 top
P1  10.16,77.47 0 top
P2  34.29,77.47 0 top
P3  72.39,77.47 0 top
P4  96.52,77.47 0 top
P5  53.34,69.85 0 top
R1  6.35,57.15 270 top
R2  8.89,57.15 270 top
R3  106.68,-41.91 90 top  (outside the outline)
R4  15.24,50.8 0 top
R5  128.27,5.08 0 top
R6  119.38,-1.27 180 top
R7  95.25,-19.05 0 top  (outside the outline)
R8  110.49,-10.16 180 top  (outside the outline)
R9  60.33,96.52 0 top
R10  46.36,96.52 0 top
R12  46.36,30.48 0 top
R13  110.49,-7.62 0 top  (outside the outline)
R14  110.49,-1.27 90 top
R15  110.49,-12.7 0 top  (outside the outline)
R16  110.49,-19.05 270 top  (outside the outline)
R17  52.07,97.79 90 top
R18  203.2,-36.83 0 top  (outside the outline)
R19  35.56,50.8 90 top
R20  133.35,-44.45 90 top  (outside the outline)
R21  128.27,-30.48 180 top  (outside the outline)
R22  128.27,-15.24 180 top  (outside the outline)
R23  128.27,0 180 top
R24  128.27,-5.08 180 top  (outside the outline)
R25  128.27,-35.56 180 top  (outside the outline)
R26  128.27,-33.02 180 top  (outside the outline)
R27  128.27,-27.94 180 top  (outside the outline)
R28  78.61,-3.56 180 top  (outside the outline)
R29  119.38,-3.81 180 top  (outside the outline)
R30  119.38,-6.35 180 top  (outside the outline)
R31  128.27,-10.16 0 top  (outside the outline)
R32  128.27,2.54 180 top
R33  121.05,-38.05 270 top  (outside the outline)
R34  109.22,-41.91 270 top  (outside the outline)
R35  118.23,-40.59 270 top  (outside the outline)
R36  128.27,-45.72 0 top  (outside the outline)
R37  111.76,-41.91 270 top  (outside the outline)
R38  128.27,-48.26 180 top  (outside the outline)
R39  -20.32,20.32 0 top  (outside the outline)
R40  -35.56,12.7 0 top  (outside the outline)
R41  128.27,-17.78 0 top  (outside the outline)
R42  45.72,-3.81 0 top  (outside the outline)
R43  29.21,50.8 0 top
R44  68.58,50.8 90 top
R45  71.12,50.8 90 top
R46  77.47,50.8 0 top
R47  97.79,57.15 90 top
R48  100.33,57.15 90 top
R49  91.44,50.8 0 top
R50  7.62,86.36 0 top
R54  -20.32,16.51 0 top  (outside the outline)
R55  -35.56,8.89 0 top  (outside the outline)
R57  45.72,22.86 0 top
R58  45.72,-7.62 0 top  (outside the outline)
R59  185.42,-7.62 0 top  (outside the outline)
R60  -35.56,-5.08 0 top  (outside the outline)
R61  -20.32,12.7 0 top  (outside the outline)
R63  -20.32,5.08 0 top  (outside the outline)
R64  203.2,-40.64 0 top  (outside the outline)
R65  203.2,-44.45 0 top  (outside the outline)
R66  203.2,-48.26 0 top  (outside the outline)
R67  54.61,97.79 90 top
R68  45.72,-11.43 0 top  (outside the outline)
R69  21.59,22.86 0 top
R70  21.59,19.05 0 top
R71  21.59,15.24 0 top
R72  21.59,-3.81 0 top  (outside the outline)
R73  21.59,-7.62 0 top  (outside the outline)
R74  21.59,-11.43 0 top  (outside the outline)
R75  21.59,-15.24 0 top  (outside the outline)
R76  21.59,-19.05 0 top  (outside the outline)
R77  21.59,-22.86 0 top  (outside the outline)
SW1  15.24,43.18 0 top
SW2  29.21,43.18 0 top
SW3  77.47,43.18 0 top
SW4  91.44,43.18 0 top
SW5  53.34,85.09 180 top
T1  7.62,49.53 180 bottom
T2  36.83,44.45 180 top
T3  69.85,44.45 180 top
T4  99.06,50.8 180 top
T5  -36.83,17.78 0 top  (outside the outline)
T6  -20.32,0 0 top  (outside the outline)
U$1  [2,8]  6.35,43.18 0 top
U$2  [2,8]  100.33,43.18 0 top
U$4  96.52,111.76 0 top
U$5  9.53,111.76 0 top
U$6  [3,6]  188.02,30.4 0 top
U$7  [3,6]  188.02,114.4 0 top
U$8  [3,6]  297.52,114.4 0 top
U$9  [3,6]  297.52,30.4 0 top
U$10  44.45,119.38 180 bottom
VBUS  32.03,119.92 0 top
X3  76.2,110.49 0 top
X5  24.13,106.68 0 top

### Tracks (layer width: path | path; a pad name or v marks a point on that pad's centre or on a via)
+3V3  (11 unrouted)
+5V  (20 unrouted)
+VIN  (1 unrouted)
A1_ADC  (2 unrouted)
A2_ADC  (1 unrouted)
A2_LEDPWM2  (4 unrouted)
A3_ADC  (2 unrouted)
A4_ADC  (1 unrouted)
A5_DAC1  (1 unrouted)
A13_TR_OUT  (2 unrouted)
A13_TR_OUT1  (1 unrouted)
A17_SW1  (16 unrouted)
A18_ADC  (2 unrouted)
A19_ADC  (1 unrouted)
A20_ADC  (2 unrouted)
A21_ADC  (1 unrouted)
A22_DAC2  (1 unrouted)
A23_ADC  (1 unrouted)
A25_SW5  (2 unrouted)
AIN_A  (3 unrouted)
AIN_B  (3 unrouted)
AOUT_A+  (1 unrouted)
AOUT_A-  (1 unrouted)
AOUT_B+  (1 unrouted)
AOUT_B-  (1 unrouted)
BOOT0  (1 unrouted)
CS_VREF  (4 unrouted)
DC_IN_L  (3 unrouted)
DC_IN_R  (3 unrouted)
DC_OUT_L  (1 unrouted)
DC_OUT_R  (1 unrouted)
GND  (95 unrouted)
  pour Bottom: 0.06,36.83 0.06,124.46 106.74,124.46 106.74,36.83
  pour Top: -1.21,35.56 -1.21,125.73 108.01,125.73 108.01,35.56
IN_L  (2 unrouted)
IN_R  (2 unrouted)
N$1  (1 unrouted)
N$2  (1 unrouted)
N$3  (2 unrouted)
N$4  (2 unrouted)
N$5  (2 unrouted)
N$6  (2 unrouted)
N$7  (2 unrouted)
N$8  (1 unrouted)
N$9  (1 unrouted)
N$10  (1 unrouted)
N$11  (2 unrouted)
N$12  (4 unrouted)
N$13  (1 unrouted)
N$14  (1 unrouted)
N$15  (3 unrouted)
N$16  (1 unrouted)
N$17  (4 unrouted)
N$18  (1 unrouted)
N$19  (1 unrouted)
N$20  (2 unrouted)
N$21  (2 unrouted)
N$22  (1 unrouted)
N$23  (2 unrouted)
N$24  (3 unrouted)
N$25  (2 unrouted)
N$26  (2 unrouted)
N$27  (1 unrouted)
N$28  (1 unrouted)
N$29  (2 unrouted)
N$30  (2 unrouted)
N$31  (1 unrouted)
N$32  (3 unrouted)
N$33  (1 unrouted)
N$34  (1 unrouted)
N$35  (1 unrouted)
N$36  (2 unrouted)
N$37  (2 unrouted)
N$38  (1 unrouted)
N$39  (4 unrouted)
N$40  (1 unrouted)
N$41  (3 unrouted)
N$42  (2 unrouted)
N$43  (1 unrouted)
N$44  (1 unrouted)
N$45  (1 unrouted)
N$46  (1 unrouted)
N$52  (4 unrouted)
N$53  (1 unrouted)
N$54  (1 unrouted)
N$58  (4 unrouted)
N$59  (1 unrouted)
N$60  (1 unrouted)
N$61  (2 unrouted)
N$62  (2 unrouted)
N$63  (1 unrouted)
N$64  (4 unrouted)
N$65  (1 unrouted)
N$66  (1 unrouted)
N$67  (1 unrouted)
OUT_L  (2 unrouted)
OUT_R  (2 unrouted)
USBD_DM  (1 unrouted)
USBD_DP  (1 unrouted)
USBD_VBUS  (2 unrouted)
USBH_DM  (1 unrouted)
USBH_DP  (1 unrouted)
USBH_VBUS  (2 unrouted)

### Text on the board
tPlace: Rebel Technology | Wizard Rev02
bPlace: Rebel Technology | Wizard Rev02